# EAGLE schematic spinsmoothly (EAGLE 8.2.2)
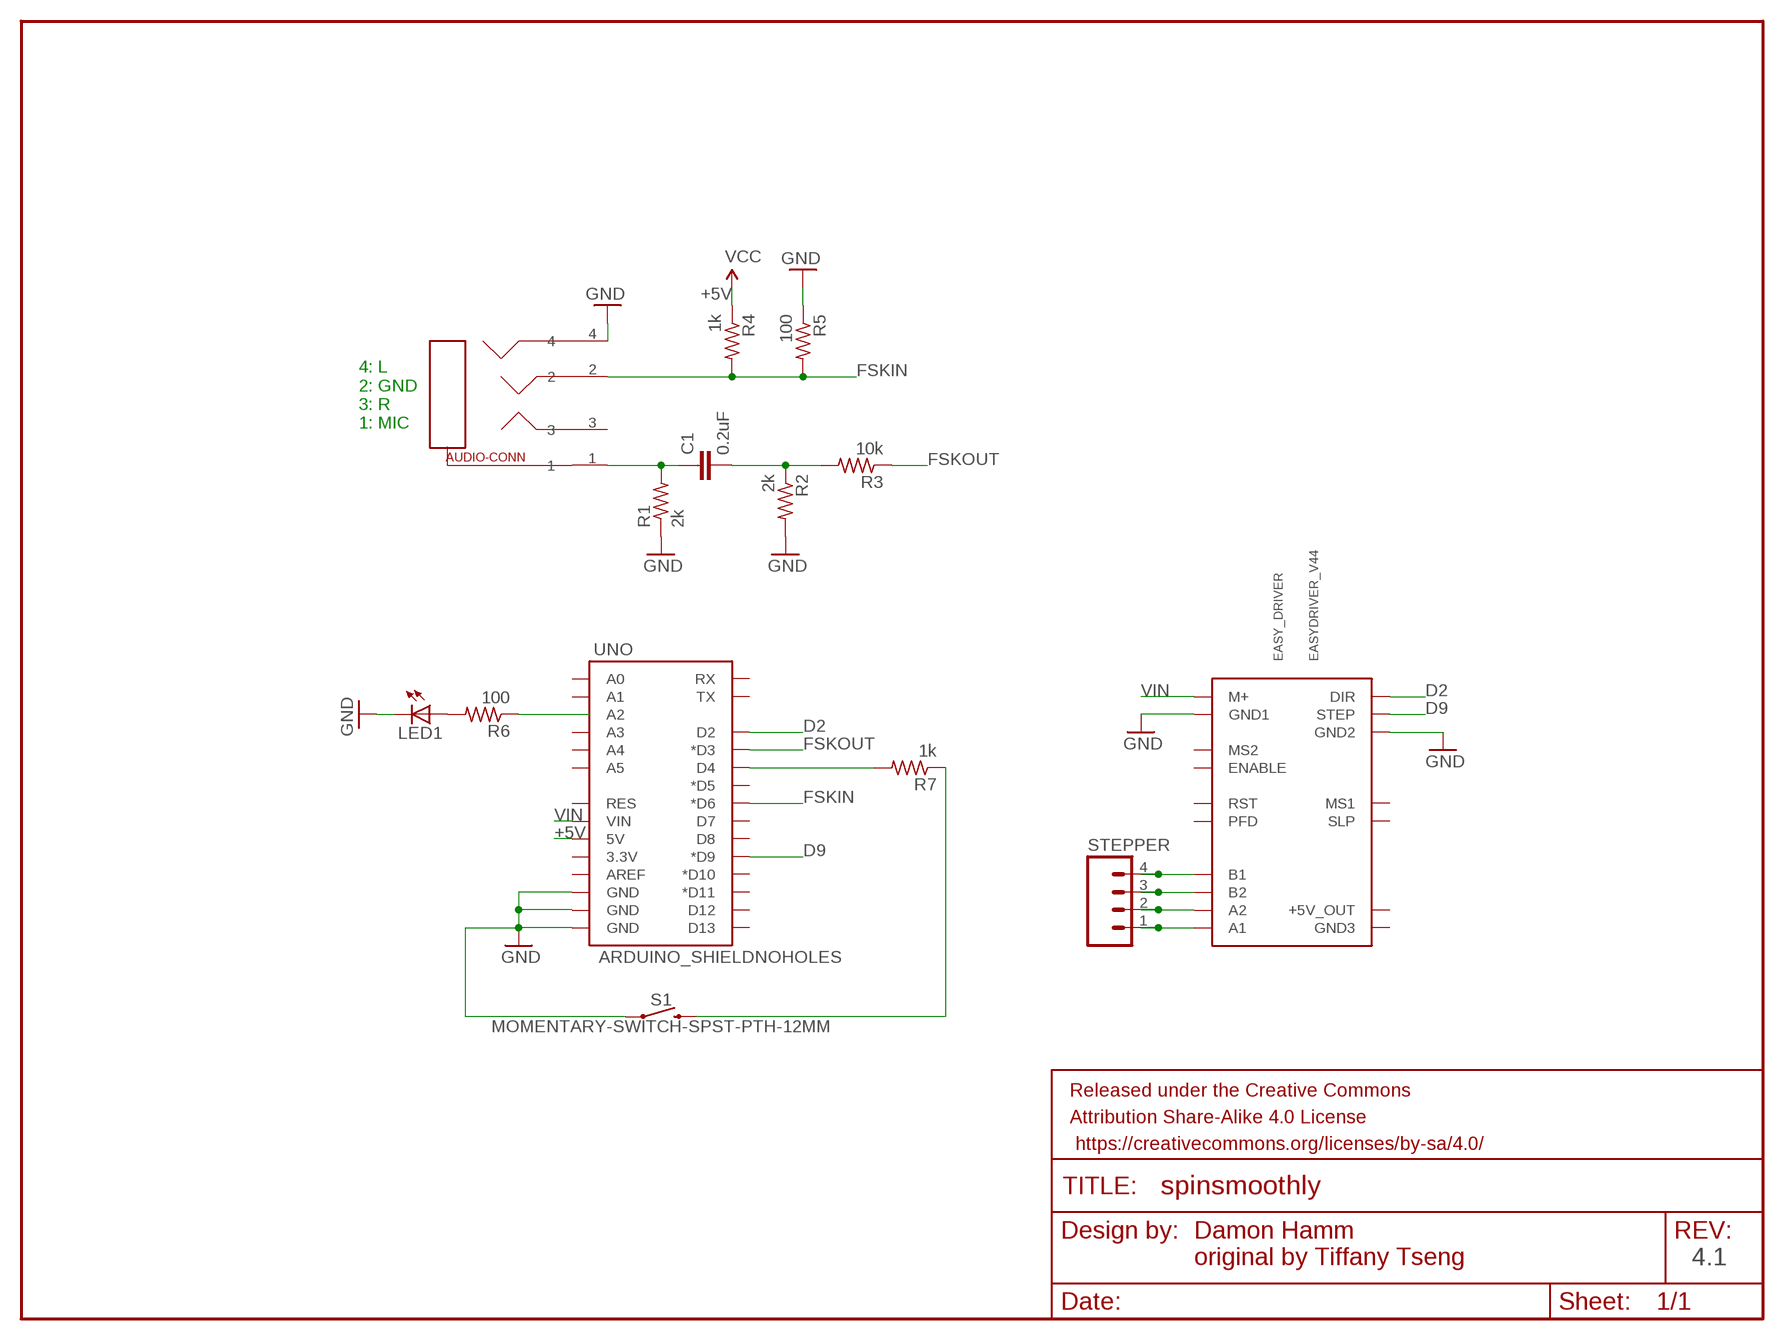
[diagram p0: schematic, sheet 1]

## Parts
C1  0.2uF  CAP1206  [1206]
EASY_DRIVER  EASYDRIVER_V44  [EASYDRIVER_V44]
FRAME1  FRAME-LETTER  [CREATIVE_COMMONS]
LED1  LED1206  [1206]
R1  2k  R-US_R1206  [R1206]
R2  2k  R-US_R1206  [R1206]
R3  10k  R-US_R1206  [R1206]
R4  1k  R-US_R1206  [R1206]
R5  100  R-US_R1206  [R1206]
R6  100  R-US_R1206  [R1206]
R7  1k  R-US_R1206  [R1206]
S1  MOMENTARY-SWITCH-SPST-PTH-12MM  [TACTILE_SWITCH_PTH_12MM]
STEPPER  M04PTH  [1X04]
U$1  SJ-43514  [SJ-43514]
UNO  ARDUINO_SHIELDNOHOLES  [DUEMILANOVE_SHIELD_NOHOLES]

## Nets
1: C1.1 R1.2 U$1.1
+5V: R4.1 UNO.5V ; supply symbol labelled VCC
D2: EASY_DRIVER.DIR UNO.D2
D9: EASY_DRIVER.STEP UNO.D9(*D9)
FSKIN: R4.2 R5.2 U$1.2 UNO.D6(*D6)
FSKOUT: R3.1 UNO.D3(*D3)
GND: EASY_DRIVER.GND1 EASY_DRIVER.GND2 LED1.2(C) R1.1 R2.2 R5.1 S1.1 U$1.4 UNO.GND@0(GND) UNO.GND@1(GND) UNO.GND@2(GND)
N$1: R7.2 UNO.D4
N$2: C1.2 R2.1 R3.2
N$3: R7.1 S1.3
N$4: EASY_DRIVER.B1 STEPPER.4
N$5: EASY_DRIVER.B2 STEPPER.3
N$6: EASY_DRIVER.A2 STEPPER.2
N$7: EASY_DRIVER.A1 STEPPER.1
N$11: LED1.1(A) R6.2
N$17: R6.1
VIN: EASY_DRIVER.M+ UNO.VIN
Unconnected: EASY_DRIVER.ENABLE EASY_DRIVER.GND3 EASY_DRIVER.MS1 EASY_DRIVER.MS2 EASY_DRIVER.P$11(+5V_OUT) EASY_DRIVER.PFD EASY_DRIVER.RST EASY_DRIVER.SLEEP(SLP) U$1.3 UNO.3.3V UNO.A0 UNO.A1 UNO.A2 UNO.A3 UNO.A4 UNO.A5 UNO.AREF UNO.D5(*D5) UNO.D7 UNO.D8 UNO.D10(*D10) UNO.D11(*D11) UNO.D12 UNO.D13 UNO.RES UNO.RX UNO.TX

## Notes on the sheet
- 4: L
  2: GND
  3: R
  1: MIC
- Damon Hamm
  original by Tiffany Tseng
- 4.1

## Library data of the parts
C1 = SparkFun-Passives:CAP: Capacitor Standard 0603 ceramic capacitor, and 0.1" leaded capacitor.
EASY_DRIVER = EasyDriver:EASYDRIVER_V44: EasyDriver version 4.4 - http://www.schmalzhaus.com/EasyDriver
FRAME1 = SparkFun-Aesthetics:FRAME-LETTER: Schematic Frame - Letter Standard 8.5x11 US Letter frame
LED1 = ng:LED
R1-R7 = rcl:R-US_: RESISTOR, American symbol
S1 = SparkFun-Switches:MOMENTARY-SWITCH-SPST: Momentary Switch (Pushbutton) - SPST Normally-open (NO) SPST momentary switches (buttons, pushbuttons). Variants PTH-12MM - 12mm square, through-hole Momentary Pushbutton Switch - 12mm Square <https://www.sparkfun.com/products/9190> (COM-09190) PTH-6.0MM, PTH-6.0MM-KIT - 6.0mm square, through-hole Mini Pushbutton Switch <https://www.sparkfun.com/products/97> (COM-00097) KIT package intended for soldering kit's - only one side of pads' copper is exposed. PTH-RIGHT-ANGLE-KIT - Right-angle, through-hole Right Angle Tactile Button <https://www.sparkfun.com/products/10791> - Used on SparkFun BigTime Watch Kit <https://www.sparkfun.com/products/11734> SMD-12MM - 12mm square, surface-mount Tactile Button - SMD (12mm) <https://www.sparkfun.com/products/12993> (COM-12993) Used on SparkFun PicoBoard <https://www.sparkfun.com/products/11888> SMD-4.5MM - 4.5mm Square Trackball Switch Used on SparkFun Blackberry Trackballer Breakout <https://www.sparkfun.com/products/13169> SMD-4.6MMX2.8MM - 4.60mm x 2.80mm, surface mount Used on SparkFun SAMD21 Mini Breakout <https://www.sparkfun.com/products/13664> SMD-5.2MM, SMD-5.2-REDUNDANT - 5.2mm square, surface-mount Mini Pushbutton Switch - SMD <https://www.sparkfun.com/products/8720> (COM-08720) Used on Arduino Pro Mini <https://www.sparkfun.com/products/11114> REDUNDANT package connects both switch circuits together SMD-6.0X3.5MM - 6.0 x 3.5mm, surface mount Momentary Reset Switch SMD <https://www.sparkfun.com/products/8229> (COM-08229) SMD-6.2MM-TALL - 6.2mm square, surface mount Tactile Button - SMD (6mm) <https://www.sparkfun.com/products/12992> Used on SparkFun Digital Sandbox <https://www.sparkfun.com/products/12651> SMD-RIGHT-ANGLE - Right-angle, surface mount Used on SparkFun Block for Intel® Edison - Arduino <https://www.sparkfun.com/products/13036>; PROD_ID: SWCH-09185; SF_SKU: COM-09190
STEPPER = SparkFun-Connectors:M04: Header 4 Standard 4-pin 0.1" header. Use with straight break away headers (SKU : PRT-00116), right angle break away headers (PRT-00553), swiss pins (PRT-00743), machine pins (PRT-00117), and female headers (PRT-00115). Molex polarized connector foot print use with SKU : PRT-08231 with associated crimp pins and housings. 1MM SMD Version SKU: PRT-10208
U$1 = spin:SJ-43514
UNO = SparkFun-Boards:ARDUINO_SHIELD: Arduino shield footprint

## Net classes
1 power: width 0.254 mm